# Altium schematic sheet Power supply.SchDoc
size A4; DrawnBy: Aerts Xander; SheetNumber: 1; SheetTotal: 5; Number: 1EAI_2023_12203308
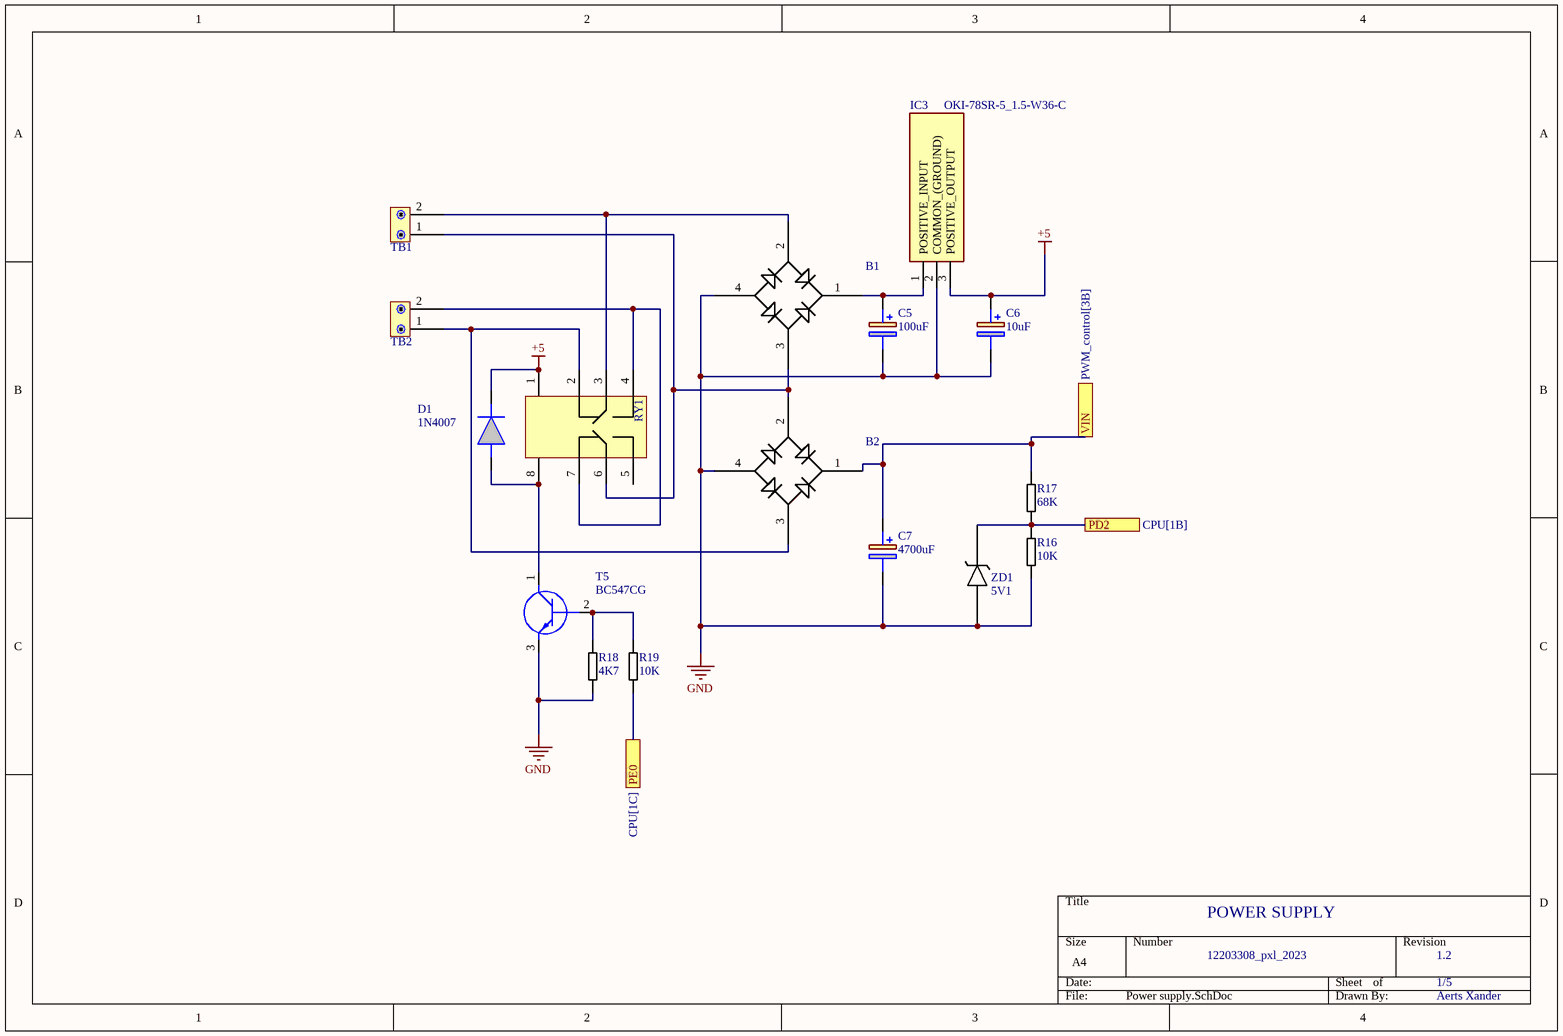
[diagram p0: Power supply.SchDoc]

## Parts
B1  Bruggelijkrichter  [Bruggelijkrichter]  (value not drawn)
B2  Bruggelijkrichter  [Bruggelijkrichter]  (value not drawn)
C5  100uF  [100uf tht]
C6  10uF  [10uF tht]
C7  4700uF  [4700uf tht]
D1  1N4007  [1n4007]
IC3  OKI-78SR-5_1.5-W36-C  [OKI-78SR-5_1.5-W36-C]
R16  10K  [0805]
R17  68K  [0805]
R18  4K7  [0805]
R19  10K  [0805]
RY1  RT424005  [RT424005]  (value not drawn)
T5  BC547CG  [BC547CG]
TB1  2pin screw connector  [2pin screw connector]  (value not drawn)
TB2  2pin screw connector  [2pin screw connector]  (value not drawn)
ZD1  5V1  [1n4007]

## Ports
PD2 (see CPU[1B]), PE0 (see CPU[1C]), VIN (see PWM_control[3B])

## Nets
+5: C6.1(+) D1.1(K) IC3.3(POSITIVE_OUTPUT) RY1.1(A1_COIL)
GND: B1.4 B2.4 C5.2(-) C6.2(-) C7.2(-) IC3.2(COMMON_(GROUND)) R16.1 R18.2 T5.3(E) ZD1.2
PD2: R16.2 R17.1 ZD1.1 ; port PD2
PE0: R19.2 ; port PE0
VIN: B2.1 C7.1(+) R17.2 ; port VIN
NetB1_1: B1.1 C5.1(+) IC3.1(POSITIVE_INPUT)
NetB1_2: B1.2 RY1.3(11_COM) TB1.2
NetB1_3: B1.3 B2.2 RY1.6(21_COM) TB1.1
NetB2_3: B2.3 RY1.2(12_NC) TB2.1
NetD1_2: D1.2(A) RY1.8(A2_COIL) T5.1(C)
NetR18_1: R18.1 R19.1 T5.2(B)
NetRY1_4: RY1.4(14_NO) RY1.7(22_NC) TB2.2

Not connected (* = marked no-connect by the designer): RY1 5(24_NO)

## Notes on the sheet
- POWER SUPPLY
- 12203308_pxl_2023
- 1.2
- 1/5
- Aerts Xander

## Library data of the parts
C5 = 100uf tht: Aluminum Electrolytic Capacitors - Radial Leaded 50V 100uF 20%-MAL213631101E3; Manufacturer_Name: Vishay; Geometry.Height: 13.5mm; Mouser Part Number: 594-MAL213631101E3; Mouser Price/Stock: https://www.mouser.co.uk/ProductDetail/Vishay-BC-Components/MAL213631101E3?qs=aJI9t0tCUiXeynxOmA%252BOhg%3D%3D; Manufacturer_Part_Number: MAL213631101E3; Datasheet Link: https://componentsearchengine.com/Datasheets/2/MAL213631101E3.pdf
C6 = 10uF tht
C7 = 4700uf tht: Cap Aluminum Lytic 4700uF 50V 20% (18 X 40mm) Radial 7.5mm 2800mA 2000h 85C Bulk; Manufacturer_Name: Rubycon; Manufacturer_Part_Number: 50PK4700MEFC18X40; Geometry.Height: 41.5mm; Mouser Part Number: 232-50PK4700MEFC18X4; Mouser Price/Stock: https://www.mouser.co.uk/ProductDetail/Rubycon/50PK4700MEFC18X40?qs=T3oQrply3y8fu7oTpkJ7DA%3D%3D; Datasheet Link: http://www.rubycon.co.jp/en/catalog/e_pdfs/aluminum/e_pk.pdf
D1 = 1N4007: Switching diode with a peak reverse voltage of 1 kV, a maximum forward current of 1 A, and a peak repetitive forward current of 5.4 A; Manufacturer_Name: Diotec; Mouser Part Number: 637-1N4007; Mouser Price/Stock: https://www.mouser.co.uk/ProductDetail/Diotec-Semiconductor/1N4007?qs=OlC7AqGiEDmK9mU1uTiCkg%3D%3D; Manufacturer_Part_Number: 1N4007; Datasheet Link: https://diotec.com/tl_files/diotec/files/pdf/datasheets/1n4001.pdf
IC3 = OKI-78SR-5_1.5-W36-C: Power Supply; Manufacturer_Name: Murata Electronics; Manufacturer_Part_Number: OKI-78SR-5/1.5-W36-C; Datasheet Link: https://www.murata.com/products/productdata/8807037992990/oki-78sr.pdf?1583754815000; Height: 16.5mm; Mouser Part Number: 580-OKI78SR5/1.5W36C; Mouser Price/Stock: https://www.mouser.co.uk/ProductDetail/Murata-Power-Solutions/OKI-78SR-5-1.5-W36-C?qs=uJpRT2lXVNXJP%252Bo08dQqJQ%3D%3D; Arrow Part Number: OKI-78SR-5/1.5-W36-C; Arrow Price/Stock: https://www.arrow.com/en/products/oki-78sr-51.5-w36-c/murata-power-solutions?region=nac
R16-R19 = resistor: Manufacturer: Vishay Dale; Part Number: CRCW08050000Z0EA
RY1 = RT424005: Relay or Contactor; Manufacturer_Name: TE Connectivity; Datasheet Link: https://www.te.com/commerce/DocumentDelivery/DDEController?Action=showdoc&DocId=Data+Sheet%7FRT2%7F1014%7Fpdf%7FEnglish%7FENG_DS_RT2_1014.pdf%7F5-1393243-9; Manufacturer_Part_Number: RT424005; Mouser Part Number: 655-RT424005; Mouser Price/Stock: https://www.mouser.co.uk/ProductDetail/TE-Connectivity-Schrack/RT424005?qs=KKrrU%252BaSadKRsQcVuAjnsQ%3D%3D; Arrow Part Number: RT424005; Arrow Price/Stock: https://www.arrow.com/en/products/rt424005/te-connectivity?region=nac
T5 = BC547CG: Transistor BJT NPN; Manufacturer_Name: onsemi; Datasheet Link: https://www.onsemi.com/pub/Collateral/BC546-D.PDF; Height: 5.33mm; Manufacturer_Part_Number: BC547CG; Mouser Part Number: 863-BC547CG; Mouser Price/Stock: https://www.mouser.co.uk/ProductDetail/onsemi/BC547CG?qs=vLkC5FC1VN%252BHx9C8w0tCew%3D%3D; Arrow Part Number: BC547CG; Arrow Price/Stock: https://www.arrow.com/en/products/bc547cg/on-semiconductor?region=nac
ZD1 = Zener 5.1 volt